# Altium schematic sheet Stepper-driver.SchDoc
size A4; SheetNumber: 2; SheetTotal: 2
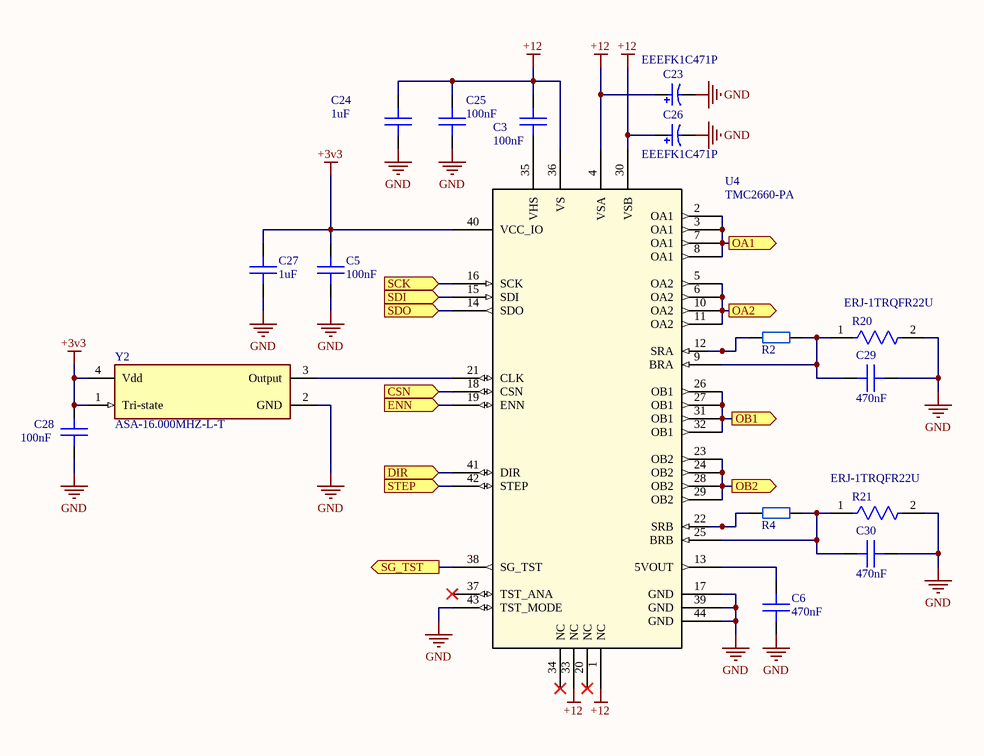
[diagram p0: Stepper-driver.SchDoc]

## Parts
C3  value 100nF  [C0603 (1608)]  (hidden comment: Cap SMD)
C5  value 100nF  [C0603 (1608)]  (hidden comment: Cap SMD)
C6  value 470nF  [C0603 (1608)]  (hidden comment: Cap SMD)
C23  EEEFK1C471P  [PNSC-FK-V-F_V]
C24  value 1uF  [C0603 (1608)]  (hidden comment: Cap SMD)
C25  value 100nF  [C0603 (1608)]  (hidden comment: Cap SMD)
C26  EEEFK1C471P  [PNSC-FK-V-F_V]
C27  value 1uF  [C0603 (1608)]  (hidden comment: Cap SMD)
C28  value 100nF  [C0603 (1608)]  (hidden comment: Cap SMD)
C29  value 470nF  [C0603 (1608)]  (hidden comment: Cap SMD)
C30  value 470nF  [C0603 (1608)]  (hidden comment: Cap SMD)
R2  Res  [R0603 (1608)]  (value not drawn)
R4  Res  [R0603 (1608)]  (value not drawn)
R20  ERJ-1TRQFR22U  [FP-ERJ1TR-MFG]
R21  ERJ-1TRQFR22U  [FP-ERJ1TR-MFG]
U4  TMC2660-PA  [LQFP44_12X12_TRI-M]
Y2  ASA-16.000MHZ-L-T  [FP-ASA-MFG]

## Ports
CSN (in), DIR (in), ENN (in), OA1 (out), OA2 (out), OB1 (out), OB2 (out), SCK (in), SDI (in), SDO (in), SG_TST (out), STEP (in)

## Nets
+3v3: C5.2 C27.2 C28.2 U4.40(VCC_IO) Y2.1(Tri-state) Y2.4(Vdd)
+12: C3.1 C23.1 C24.1 C25.1 C26.1 U4.1(NC) U4.4(VSA) U4.30(VSB) U4.33(NC) U4.36(VS)
GND: C5.1 C6.1 C23.2 C24.2 C25.2 C26.2 C27.1 C28.1 C29.1 C30.1 R20.2 R21.2 U4.17(GND) U4.39(GND) U4.43(TST_MODE) U4.44(GND) Y2.2(GND)
CSN: U4.18(CSN) ; port CSN
DIR: U4.41(DIR) ; port DIR
ENN: U4.19(ENN) ; port ENN
OA1: U4.2(OA1) U4.3(OA1) U4.7(OA1) U4.8(OA1) ; port OA1
OA2: U4.5(OA2) U4.6(OA2) U4.10(OA2) U4.11(OA2) ; port OA2
OB1: U4.26(OB1) U4.27(OB1) U4.31(OB1) U4.32(OB1) ; port OB1
OB2: U4.23(OB2) U4.24(OB2) U4.28(OB2) U4.29(OB2) ; port OB2
SCK: U4.16(SCK) ; port SCK
SDI: U4.15(SDI) ; port SDI
SDO: U4.14(SDO) ; port SDO
SG_TST: U4.38(SG_TST) ; port SG_TST
STEP: U4.42(STEP) ; port STEP
NetC3_2: C3.2 U4.35(VHS)
NetC6_2: C6.2 U4.13(5VOUT)
NetC29_2: C29.2 R2.2 R20.1 U4.9(BRA)
NetC30_2: C30.2 R4.2 R21.1 U4.25(BRB)
NetR2_1: R2.1 U4.12(SRA)
NetR4_1: R4.1 U4.22(SRB)
NetU4_21: U4.21(CLK) Y2.3(Output)

Not connected (* = marked no-connect by the designer): U4 20(NC)* 34(NC)* 37(TST_ANA)*

## Library data of the parts
C23 C26 = CMP-2000-06204-1: Aluminum Electrolytic Capacitor, 470 uF, +/- 20%, 16 V, 2-Pin SMD (Size Code F), -55 to 105 degC, RoHS, Tape and Reel; Manufacturer: Panasonic; Capacitance: 470µF; Type: Can; Ripple Current: 600mA; Lifetime@Temperature: 2000Hrs@105°C; Impedance: 0.16O; Rated Voltage: 16V; Manufacturer URL: http://www.panasonic.com/; Package Description: 2-Pin Electrolytic Aluminum Capacitor, Body 8.3 x 8.3 mm; Operating Temp-Max: 105°C; Mounting Technology: SurfaceMount; Operating Temp Range: -55to+105°C; Datasheet Version: 03/2016; Series: FK; Package Reference: FK-V-F; Case Size/Dimension: Ø8x10.2mm; Package URL: http://industrial.panasonic.com/cdbs/www-data/pdf/RDE0000/DME0000COL48.pdf; Datasheet URL: http://industrial.panasonic.com/cdbs/www-data/pdf/RDE0000/ABA0000C1181.pdf
R2 R4 = Resistor EU
R20 R21 = CMP-05422-000060-1: RES 0.22 OHM 1% 1W 2512; Manufacturer: Panasonic; 3DS Part Number: 110-00006; Value: 0.22Ω; Automotive Grade: Grade 0; Temperature Coefficient: 200ppm/°C; Digikey Description: RES 0.22 OHM 1% 1W 2512; Tolerance: 1%; Temperature Range High: +155°C; Temperature Range Low: -55°C; Series: ERJ; Category: Res; Power Rating: 1W; ComponentLink2URL: https://industrial.panasonic.com/cdbs/www-data/pdf/RDN0000/AOA0000C313.pdf; Device Class L1: Passive Components; Octopart: https://octopart.com/erj1trqfr22u-panasonic-10566390; Device Class L3: Chip SMD Resistors; Temperature: -55°C to +155°C; Composition: Thick Film; Device Class L2: Resistors; Footprint Url: https://industrial.panasonic.com/cdbs/www-data/pdf/RDN0000/DMN0000COL17.pdf; Ipc Land Pattern Name: RESC640320X60; Package: ERJ1TR; Resistance: 0.22Ω; Mouser Description: Current Sense Resistors 2512 0.22ohm 1% Curr Sense AEC-Q200; Manufacturer Part Number: ERJ-1TRQFR22U; RoHS: TRUE; ComponentLink2Description: Datasheet; Lead Free: Yes; Height: 0.7mm; Automotive: Yes
U4 = TMC2660-PA: No Description Available; Built_By: EMA_Jessica; Vendor: TRINAMIC; SourceLibrary: Trinamic_2018-10-17; Copyright: Copyright (C) 2016 Accelerated Designs. All rights reserved; Manufacturer_Part_Number: TMC2660-PA; RefDes: RefDes; Type: DEV
Y2 = CMP-27762-000001-1: XTAL OSC XO 16.0000MHZ HCMOS SMD; Manufacturer: Abracon; Max Supply Current: 5mA; Max Supply Voltage: 3.66V; Load Capacitance: 15pF; Stability: 50ppm; Frequency: 16MHz; Min Supply Voltage: 2.97V; Category: Crys; Package: ASA; Temperature Range High: +85°C; Device Class L1: Passive Components; Octopart: https://octopart.com/asa-16.000mhz-l-t-abracon-21707822; Device Class L3: Oscillators; Temperature Range Low: -40°C; ComponentLink2Description: Datasheet; Mouser Description: Standard Clock Oscillators 16.000MHz 3.3V -40C +85C; Height: 0.8mm; Series: ASA; Automotive: No; Device Class L2: Crystals / Oscillators; Manufacturer Part Number: ASA-16.000MHZ-L-T; ComponentLink2URL: https://abracon.com/Oscillators/ASA.pdf; Digikey Description: XTAL OSC XO 16.0000MHZ HCMOS SMD; Footprint Url: https://abracon.com/Support/PackageDrawing/Oscillators/ASA.PDF; Temperature: -40°C to +85°C; RoHS: TRUE; Lead Free: Yes